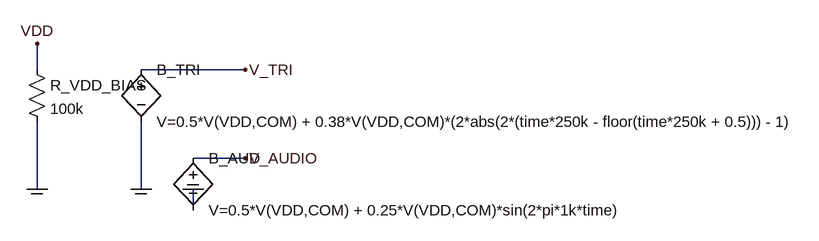
[diagram p0: schematic carrier_gen.asc]
carrier_gen.asc, the LTspice schematic file:
Version 4
SHEET 1 1200 800
FLAG 160 160 VDD
FLAG 160 384 COM
FLAG 480 200 V_TRI
FLAG 480 336 V_AUDIO
FLAG 320 384 COM
FLAG 400 384 COM
SYMBOL res 144 184 R0
SYMATTR InstName R_VDD_BIAS
SYMATTR Value 100k
WIRE 160 160 160 200
WIRE 160 280 160 384
SYMBOL bv 320 184 R0
SYMATTR InstName B_TRI
SYMATTR Value V=0.5*V(VDD,COM) + 0.38*V(VDD,COM)*(2*abs(2*(time*250k - floor(time*250k + 0.5))) - 1)
WIRE 320 200 480 200
WIRE 320 280 320 384
SYMBOL bv 400 320 R0
SYMATTR InstName B_AUD
SYMATTR Value V=0.5*V(VDD,COM) + 0.25*V(VDD,COM)*sin(2*pi*1k*time)
WIRE 400 336 480 336
WIRE 400 416 400 384

The netlist it stands for:
* carrier_gen.asc
R_VDD_BIAS VDD COM 100k
B_TRI V_TRI COM V=0.5*V(VDD,COM) + 0.38*V(VDD,COM)*(2*abs(2*(time*250k - floor(time*250k + 0.5))) - 1)
B_AUD V_AUDIO COM V=0.5*V(VDD,COM) + 0.25*V(VDD,COM)*sin(2*pi*1k*time)
.backanno
.end